# Altium schematic sheet 06-SX1276.SchDoc
size B; SheetNumber: 6; SheetTotal: 19
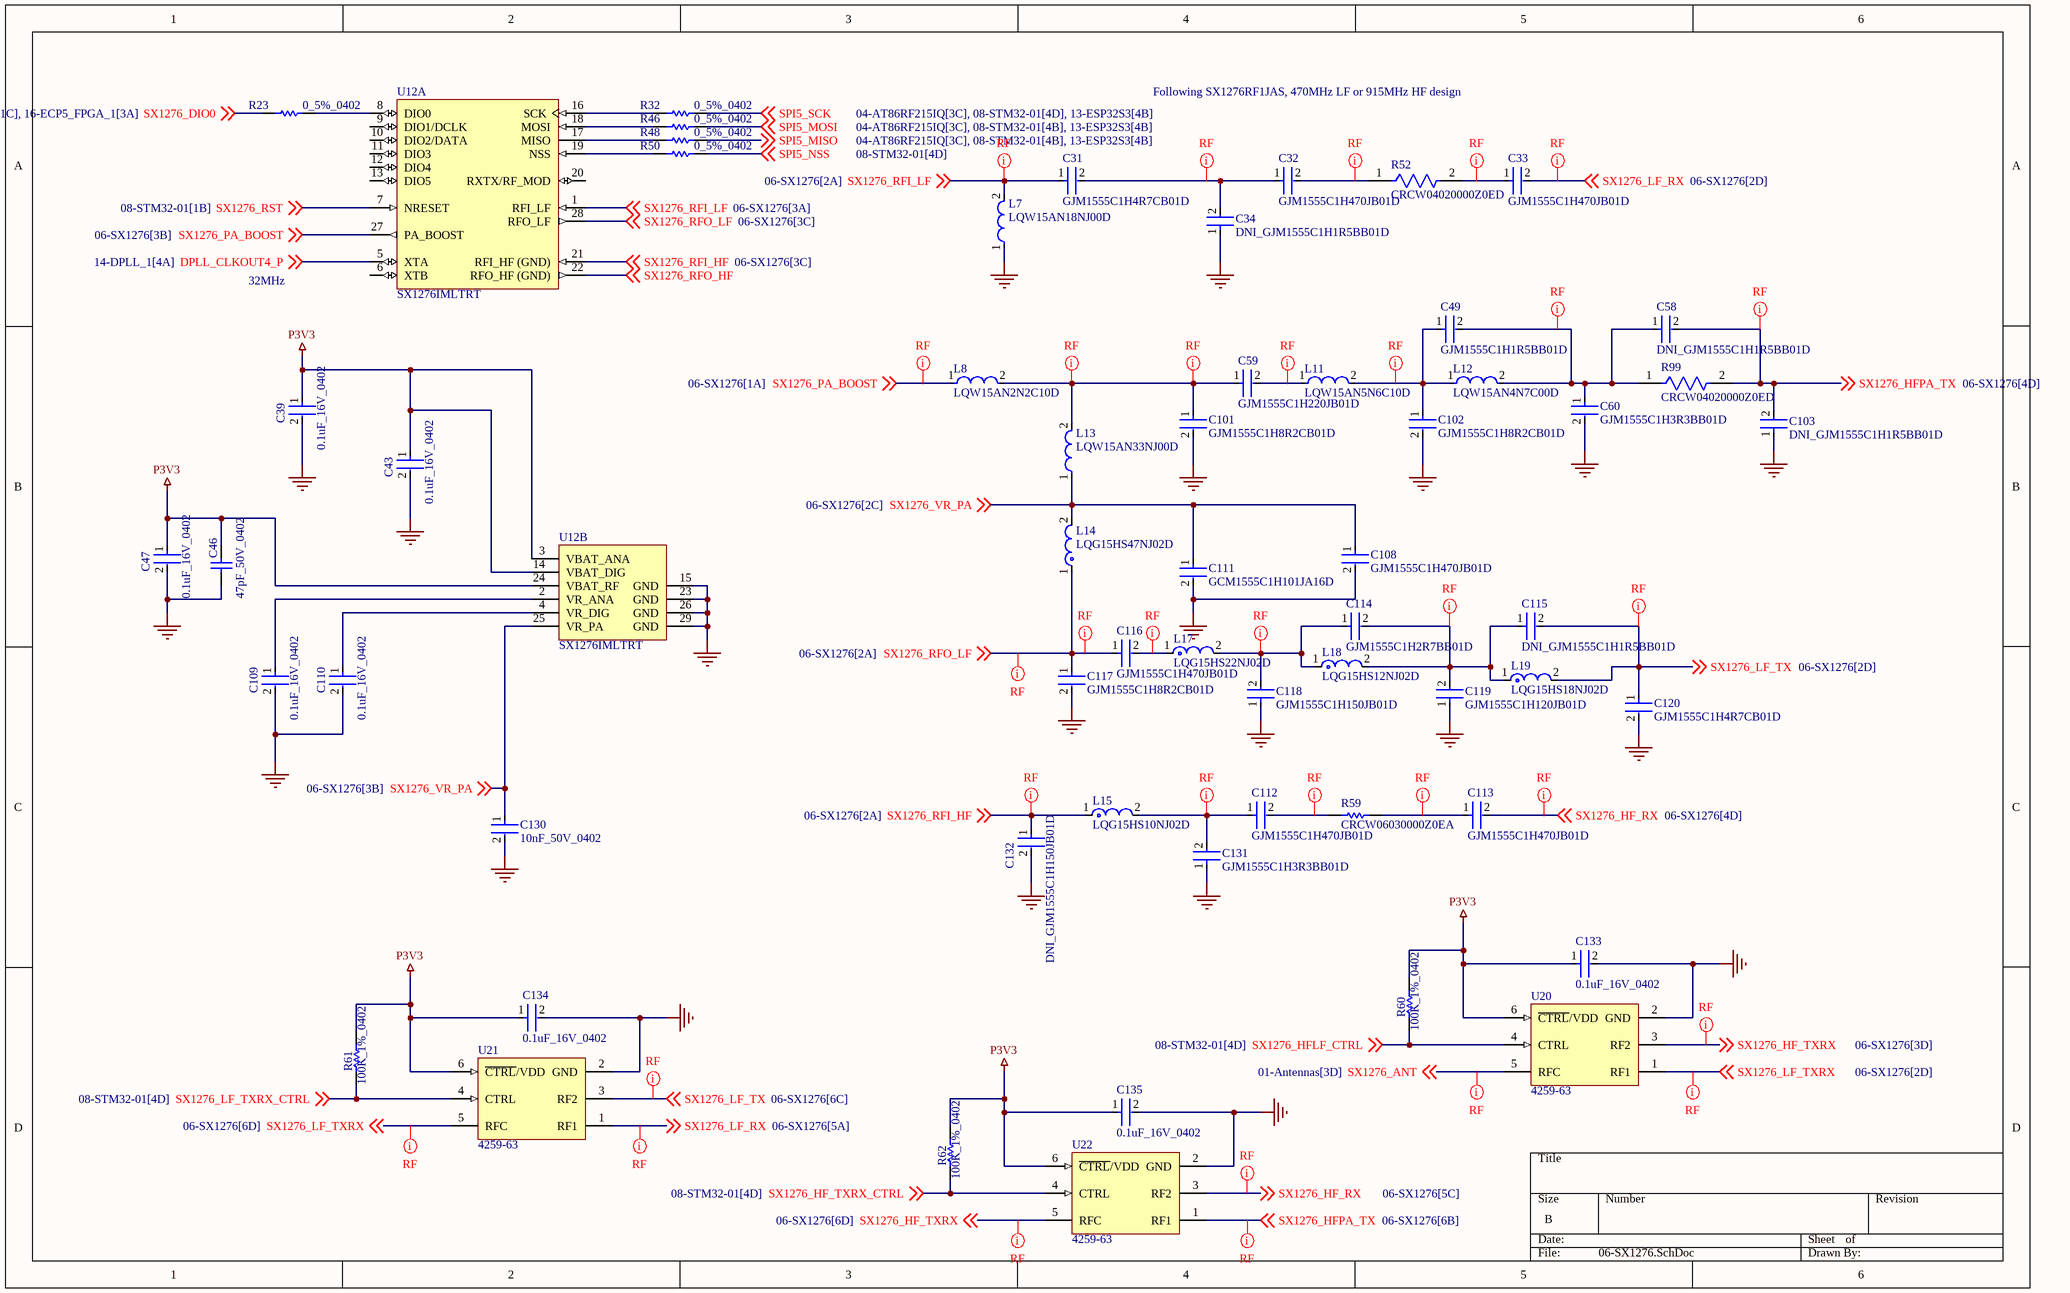
[diagram p0: 06-SX1276.SchDoc]

## Parts
C31  GJM1555C1H4R7CB01D  [FP-GJM155-0_05-IPC_B]
C32  GJM1555C1H470JB01D  [FP-GJM155-0_05-MFG]
C33  GJM1555C1H470JB01D  [FP-GJM155-0_05-MFG]
C34  DNI_GJM1555C1H1R5BB01D  [FP-GJM155-0_05-IPC_C]  (no BOM)
C39  0.1uF_16V_0402  [FP-C0402-BB-MFG]
C43  0.1uF_16V_0402  [FP-C0402-BB-MFG]
C46  47pF_50V_0402  [CAPC1005X55X25LL05T10]
C47  0.1uF_16V_0402  [FP-C0402-BB-MFG]
C49  GJM1555C1H1R5BB01D  [FP-GJM155-0_05-IPC_C]
C58  DNI_GJM1555C1H1R5BB01D  [FP-GJM155-0_05-IPC_C]  (no BOM)
C59  GJM1555C1H220JB01D  [FP-GJM155-0_05-IPC_C]
C60  GJM1555C1H3R3BB01D  [FP-GJM155-0_05-IPC_C]
C101  GJM1555C1H8R2CB01D  [FP-GJM155-0_05-IPC_C]
C102  GJM1555C1H8R2CB01D  [FP-GJM155-0_05-IPC_C]
C103  DNI_GJM1555C1H1R5BB01D  [FP-GJM155-0_05-IPC_C]  (no BOM)
C108  GJM1555C1H470JB01D  [FP-GJM155-0_05-MFG]
C109  0.1uF_16V_0402  [FP-C0402-BB-MFG]
C110  0.1uF_16V_0402  [FP-C0402-BB-MFG]
C111  GCM1555C1H101JA16D  [FP-GCM155-0_05-IPC_C]
C112  GJM1555C1H470JB01D  [FP-GJM155-0_05-MFG]
C113  GJM1555C1H470JB01D  [FP-GJM155-0_05-MFG]
C114  GJM1555C1H2R7BB01D  [FP-GJM155-0_05-IPC_A]
C115  DNI_GJM1555C1H1R5BB01D  [FP-GJM155-0_05-IPC_C]  (no BOM)
C116  GJM1555C1H470JB01D  [FP-GJM155-0_05-MFG]
C117  GJM1555C1H8R2CB01D  [FP-GJM155-0_05-IPC_C]
C118  GJM1555C1H150JB01D  [FP-GJM155-0_05-IPC_A]
C119  GJM1555C1H120JB01D  [FP-GJM155-0_05-IPC_A]
C120  GJM1555C1H4R7CB01D  [FP-GJM155-0_05-IPC_B]
C130  10nF_50V_0402  [FP-CL165-IPC_C]
C131  GJM1555C1H3R3BB01D  [FP-GJM155-0_05-IPC_C]
C132  DNI_GJM1555C1H150JB01D  [FP-GJM155-0_05-IPC_A]  (no BOM)
C133  0.1uF_16V_0402  [FP-C0402-BB-MFG]
C134  0.1uF_16V_0402  [FP-C0402-BB-MFG]
C135  0.1uF_16V_0402  [FP-C0402-BB-MFG]
L7  LQW15AN18NJ00D  [FP-LQW15AN_00-W0_6-0_1-MFG]
L8  LQW15AN2N2C10D  [FP-LQW15AN_00-W0_6-0_1-MFG]
L11  LQW15AN5N6C10D  [FP-LQW15AN_00-W0_6-0_1-MFG]
L12  LQW15AN4N7C00D  [FP-LQW15AN_00-W0_6-0_1-MFG]
L13  LQW15AN33NJ00D  [FP-LQW15AN_00-W0_5-0_1-MFG]
L14  LQG15HS47NJ02D  [FP-LQG15HH_02-IPC_B]
L15  LQG15HS10NJ02D  [FP-LQG15HH_02-IPC_A]
L17  LQG15HS22NJ02D  [FP-LQG15HH_02-MFG]
L18  LQG15HS12NJ02D  [FP-LQG15HH_02-IPC_A]
L19  LQG15HS18NJ02D  [FP-LQG15HH_02-MFG]
R23  0_5%_0402  [RESC1005X40X25NL05T10]
R32  0_5%_0402  [RESC1005X40X25NL05T10]
R46  0_5%_0402  [RESC1005X40X25NL05T10]
R48  0_5%_0402  [RESC1005X40X25NL05T10]
R50  0_5%_0402  [RESC1005X40X25NL05T10]
R52  CRCW04020000Z0ED  [FP-CRCW0402-e3-IPC_C]
R59  CRCW06030000Z0EA  [RESC1609X50X30NL8T20]
R60  100K_1%_0402  [RESC1005X40X25ML05T10]
R61  100K_1%_0402  [RESC1005X40X25ML05T10]
R62  100K_1%_0402  [RESC1005X40X25ML05T10]
R99  CRCW04020000Z0ED  [FP-CRCW0402-e3-IPC_C]
U12  SX1276IMLTRT  [SMTC-QFN-28_V]  (parts A,B of 2)
U20  4259-63  [PERE-SC-70-6_M]
U21  4259-63  [PERE-SC-70-6_M]
U22  4259-63  [PERE-SC-70-6_M]

## Nets
GND: C34.1 C39.2 C43.2 C46.1 C47.2 C60.2 C101.2 C102.2 C103.1 C108.2 C109.2 C110.2 C111.2 C117.2 C118.1 C119.1 C120.2 C130.2 C131.1 C132.2 C133.2 C134.2 C135.2 L7.1 U12.15(GND) U12.23(GND) U12.26(GND) U12.29(GND) U20.2(GND) U21.2(GND) U22.2(GND)
P3V3: C39.1 C43.1 C46.2 C47.1 C133.1 C134.1 C135.1 R60.2 R61.2 R62.2 U12.3(VBAT_ANA) U12.14(VBAT_DIG) U12.24(VBAT_RF) U20.6(~{CTRL}/VDD) U21.6(~{CTRL}/VDD) U22.6(~{CTRL}/VDD)
DPLL_CLKOUT4_P: U12.5(XTA) ; off-sheet DPLL_CLKOUT4_P
SPI5_MISO: R48.2 ; off-sheet SPI5_MISO
SPI5_MOSI: R46.2 ; off-sheet SPI5_MOSI
SPI5_NSS: R50.2 ; off-sheet SPI5_NSS
SPI5_SCK: R32.2 ; off-sheet SPI5_SCK
SX1276_ANT: U20.5(RFC) ; off-sheet SX1276_ANT
SX1276_DIO0: R23.1 ; off-sheet SX1276_DIO0
SX1276_HF_RX: C113.2 U22.3(RF2) ; off-sheet SX1276_HF_RX
SX1276_HF_TXRX: U20.3(RF2) U22.5(RFC) ; off-sheet SX1276_HF_TXRX
SX1276_HF_TXRX_CTRL: R62.1 U22.4(CTRL) ; off-sheet SX1276_HF_TXRX_CTRL
SX1276_HFLF_CTRL: R60.1 U20.4(CTRL) ; off-sheet SX1276_HFLF_CTRL
SX1276_HFPA_TX: C58.2 C103.2 R99.2 U22.1(RF1) ; off-sheet SX1276_HFPA_TX
SX1276_LF_RX: C33.2 U21.1(RF1) ; off-sheet SX1276_LF_RX
SX1276_LF_TX: C115.2 C120.1 L19.2 U21.3(RF2) ; off-sheet SX1276_LF_TX
SX1276_LF_TXRX: U20.1(RF1) U21.5(RFC) ; off-sheet SX1276_LF_TXRX
SX1276_LF_TXRX_CTRL: R61.1 U21.4(CTRL) ; off-sheet SX1276_LF_TXRX_CTRL
SX1276_PA_BOOST: L8.1 U12.27(PA_BOOST) ; off-sheet SX1276_PA_BOOST
SX1276_RFI_HF: C132.1 L15.1 U12.21(RFI_HF_(GND)) ; off-sheet SX1276_RFI_HF
SX1276_RFI_LF: C31.1 L7.2 U12.1(RFI_LF) ; off-sheet SX1276_RFI_LF
SX1276_RFO_HF: U12.22(RFO_HF_(GND)) ; off-sheet SX1276_RFO_HF
SX1276_RFO_LF: C116.1 C117.1 L14.1 U12.28(RFO_LF) ; off-sheet SX1276_RFO_LF
SX1276_RST: U12.7(NRESET) ; off-sheet SX1276_RST
SX1276_VR_PA: C108.1 C111.1 C130.1 L13.1 L14.2 U12.25(VR_PA) ; off-sheet SX1276_VR_PA
NetC31_2: C31.2 C32.1 C34.2
NetC32_2: C32.2 R52.1
NetC33_1: C33.1 R52.2
NetC49_1: C49.1 C102.1 L11.2 L12.1
NetC49_2: C49.2 C58.1 C60.1 L12.2 R99.1
NetC59_1: C59.1 C101.1 L8.2 L13.2
NetC59_2: C59.2 L11.1
NetC109_1: C109.1 U12.2(VR_ANA)
NetC110_1: C110.1 U12.4(VR_DIG)
NetC112_1: C112.1 C131.2 L15.2
NetC112_2: C112.2 R59.1
NetC113_1: C113.1 R59.2
NetC114_1: C114.1 C118.2 L17.2 L18.1
NetC114_2: C114.2 C115.1 C119.2 L18.2 L19.1
NetC116_2: C116.2 L17.1
NetR23_2: R23.2 U12.8(DIO0)
NetR32_1: R32.1 U12.16(SCK)
NetR46_1: R46.1 U12.18(MOSI)
NetR48_1: R48.1 U12.17(MISO)
NetR50_1: R50.1 U12.19(NSS)

Not connected (* = marked no-connect by the designer): U12 6(XTB) 9(DIO1/DCLK) 10(DIO2/DATA) 11(DIO3) 12(DIO4) 13(DIO5) 20(RXTX/RF_MOD)

## Layout directives
net class RF: NetC31_2, NetC32_2, NetC33_1, NetC49_1, NetC49_2, NetC59_1, NetC59_2, NetC112_1, NetC112_2, NetC113_1, NetC114_1, NetC114_2, NetC116_2, SX1276_ANT, SX1276_HF_RX, SX1276_HF_TXRX, SX1276_HFPA_TX, SX1276_LF_RX, SX1276_LF_TX, SX1276_LF_TXRX, SX1276_PA_BOOST, SX1276_RFI_HF, SX1276_RFI_LF, SX1276_RFO_LF

## Notes on the sheet
- Following SX1276RF1JAS, 470MHz LF or 915MHz HF design
- 32MHz

## Library data of the parts
C31 C120 = CMP-2008-03859-2: Multi-Layer Ceramic Capacitor 4.7pF C0G  ±0.25pF 0402 Paper T/R; Voltage Rating (DC): 50V; Temperature Coefficient: 30ppm/°C; Case/Package: 0402; Packaging: Tape and Reel; Package Quantity: 10000; Depth: 0.5mm; REACH SVHC: No SVHC; Height: 0.5mm; Lead Free: Lead Free; Number of Pins: 2; Case Code (Imperial): 0402; Width: 0.02inch; Max Operating Temperature: 125°C; Capacitance: 4.7pF; Dielectric: C0G; Lead Pitch: 0.3mm; Voltage Rating: 50V; Min Operating Temperature: -55°C; Thickness: 0.022inch; Voltage: 50V; Radiation Hardening: No; Mount: Surface Mount; Termination: SMD/SMT; Case Code (Metric): 1005; Length: 1mm
C32 C33 C108 C112 C113 C116 = CMP-06035-013708-1: Multi-Layer Ceramic Capacitor 47pF C0G  ±5% 0402 Paper T/R; Voltage Rating (DC): 50V; Capacitance: 47pF; Tolerance: 5%; Dielectric: C0G; Thickness: 500um; Length: 1mm; Width: 500um
C34 C49 C58 C103 C115 = CMP-2008-03820-2: Multi-Layer Ceramic Capacitor 1.5pF C0G  ±0.1pF 0402 Paper T/R; Temperature Coefficient: 30ppm/°C; Voltage Rating: 50V; Depth: 0.5mm; Case Code (Imperial): 0402; Package Quantity: 10000; Length: 1mm; Number of Pins: 2; Max Operating Temperature: 125°C; Mount: Surface Mount; Construction: Flat; Thickness: 0.022inch; Series: GJM; Packaging: Tape and Reel; Radiation Hardening: No; REACH SVHC: No SVHC; Case/Package: 0402; Lead Free: Lead Free; Voltage Rating (DC): 50V; Min Operating Temperature: -55°C; Dielectric: C0G; Termination: SMD/SMT; Width: 0.5mm; Capacitance: 1.5pF; Lead Pitch: 0.3mm; Case Code (Metric): 1005; Voltage: 50V; Height: 0.5mm
C39 C43 C47 C109 C110 C133-C135 = CMP-1034-02068-3: CAP CER 0.1UF 16V 5% X7R 0402; Manufacturer: Kemet; Manufacturer Part Number: C0402C104J4RACTU; Value: 0.10 μF; Temperature Coefficient: 15%; Tolerance: 0.05; Material: Ceramic; ComponentLink2URL: https://content.kemet.com/datasheets/KEM_C1002_X7R_SMD.pdf; Automotive: No; Device Class L2: Capacitors; Temperature: -55°C to +125°C; RoHS: TRUE; Voltage Rating: 16 V; ComponentLink2Description: Datasheet; Device Class L3: Ceramic Capacitors; Temperature Range Low: -55°C; Ipc Land Pattern Name: CAPC10050X50; Device Class L1: Passive Components; Temperature Range High: +125°C; Package: C0402-BB; Capacitance: 0.10 μF; Category: Cap; Mouser Description: CAP CER 0.1UF 16V X7R 0402; Height: 0.55mm; Digikey Description: CAP CER 0.1UF 16V 5% X7R 0402; Octopart: https://octopart.com/c0402c104j4ractu-kemet-12573893; Temperature Characteristic: X7R; Lead Free: Yes
C46 = CMP-2008-04368-1: Part Number: GRM1555C1H470JA01D; Manufacturer: Murata
C59 = CMP-06035-006261-1: Multi-Layer Ceramic Capacitor 22pF C0G  ±5% 0402 Paper T/R; Voltage Rating (DC): 50V; Length: 1mm; Width: 500um; Dielectric: C0G; Capacitance: 22pF; Thickness: 500um; Tolerance: 5%
C60 C131 = CMP-2008-03846-2: Multi-Layer Ceramic Capacitor 3.3pF C0G  ±0.1pF 0402 Paper T/R; Voltage: 50V; Lead Free: Lead Free; Thickness: 0.022inch; Mount: Surface Mount; Termination: SMD/SMT; Package Quantity: 1; Lead Pitch: 0.3mm; Case/Package: 0402; REACH SVHC: No SVHC; Case Code (Imperial): 0402; Number of Pins: 2; Height: 0.5mm; Width: 0.5mm; Depth: 0.5mm; Capacitance: 3.3pF; Packaging: Tape and Reel; Min Operating Temperature: -55°C; Length: 1mm; Dielectric: C0G; Case Code (Metric): 1005; Max Operating Temperature: 125°C; Voltage Rating (DC): 50V; Voltage Rating: 50V; Radiation Hardening: No
C101 C102 C117 = CMP-2008-03886-2: Multi-Layer Ceramic Capacitor 8.2pF C0G  ±0.25pF 0402 Paper T/R; Temperature Coefficient: 30ppm/°C; Voltage: 50V; Case Code (Metric): 1005; Max Operating Temperature: 125°C; Dielectric: C0G; Lead Free: Lead Free; Case/Package: 0402; Radiation Hardening: No; Length: 1mm; Thickness: 0.022inch; Case Code (Imperial): 0402; Number of Pins: 2; Depth: 0.5mm; Mount: Surface Mount; Termination: SMD/SMT; Voltage Rating (DC): 50V; Package Quantity: 1; Packaging: Tape and Reel; REACH SVHC: No SVHC; Min Operating Temperature: -55°C; Height: 0.5mm; Lead Pitch: 0.3mm; Capacitance: 8.2pF; Width: 0.5mm; Voltage Rating: 50V
C111 = CMP-2008-03694-3: Ceramic Capacitor for Automotive 100pF ±5% 50VDC C0G 0402 Paper T/R; Voltage: 50V; Ratings: AEC-Q200; Radiation Hardening: No; Min Operating Temperature: -55°C; Capacitance: 100pF; Depth: 0.5mm; Max Operating Temperature: 125°C; Length: 1mm; Height: 0.5mm; Termination: SMD/SMT; Voltage Rating: 50V; Dielectric: C0G; Package Quantity: 10000; Case Code (Imperial): 0402; Width: 0.02inch; Case/Package: 0402; Lead Free: Lead Free; Case Code (Metric): 1005; Voltage Rating (DC): 50V; Thickness: 0.022inch; Mount: Surface Mount; Tolerance: 5%; REACH SVHC: No SVHC; Weight: 0.000212oz; Packaging: Tape and Reel
C114 = CMP-2008-03840-2: Multi-Layer Ceramic Capacitor 2.7pF C0G  ±0.1pF 0402 Paper T/R; Voltage Rating (DC): 50V; Temperature Coefficient: 30ppm/°C; Max Operating Temperature: 125°C; Lead Free: Lead Free; REACH SVHC: No SVHC; Thickness: 0.022inch; Length: 1mm; Height: 0.5mm; Min Operating Temperature: -55°C; Mount: Surface Mount; Case/Package: 0402; Case Code (Imperial): 0402; Width: 0.02inch; Capacitance: 2.7pF; Packaging: Tape and Reel; Package Quantity: 10000; Lead Pitch: 0.3mm; Dielectric: C0G; Depth: 0.5mm; Voltage Rating: 50V; Radiation Hardening: No; Termination: SMD/SMT; Voltage: 50V; Number of Pins: 2; Case Code (Metric): 1005
C118 C132 = CMP-2008-03804-2: Multi-Layer Ceramic Capacitor 15pF C0G  ±5% 0402 Paper T/R; Voltage Rating (DC): 50V; Temperature Coefficient: 30ppm/°C; Dielectric: C0G; Max Operating Temperature: 125°C; Radiation Hardening: No; REACH SVHC: No SVHC; Case Code (Imperial): 0402; Package Quantity: 1; Thickness: 0.022inch; Min Operating Temperature: -55°C; Mount: Surface Mount; Tolerance: 5%; Voltage Rating: 50V; Depth: 0.5mm; Width: 0.02inch; Height: 0.5mm; Number of Pins: 2; Case Code (Metric): 1005; Lead Pitch: 0.3mm; Case/Package: 0402; Termination: SMD/SMT; Voltage: 50V; Length: 1mm; Capacitance: 15pF; Packaging: Tape and Reel; Lead Free: Lead Free
C119 = CMP-2008-03800-2: Multi-Layer Ceramic Capacitor 12pF C0G  ±5% 0402 Paper T/R; Voltage: 50V; Temperature Coefficient: 30ppm/°C; Tolerance: 5%; Package Quantity: 1; Dielectric: C0G; Height: 0.5mm; Voltage Rating: 50V; Radiation Hardening: No; Capacitance: 12pF; REACH SVHC: No SVHC; Voltage Rating (DC): 50V; Number of Pins: 2; Depth: 0.5mm; Mount: Surface Mount; Lead Free: Lead Free; Lead Pitch: 0.3mm; Width: 0.5mm; Min Operating Temperature: -55°C; Length: 1mm; Case/Package: 0402; Thickness: 0.022inch; Case Code (Metric): 1005; Packaging: Tape and Reel; Max Operating Temperature: 125°C; Case Code (Imperial): 0402; Termination: SMD/SMT
C130 = CMP-13271-000387-1: Cap Ceramic 10nF 50V X7R ±10% SMD 0402 +125°C Paper T/R; Depth: 0.5mm; Length: 1mm; Lead Free: Lead Free; Case Code (Metric): 1005; Width: 0.02inch; Min Operating Temperature: -55°C; Thickness: 0.022inch; Package Quantity: 1; Mount: Surface Mount; Height: 0.5mm; Voltage: 50V; Material: Ceramic; Tolerance: 10%; Case Code (Imperial): 0402; Radiation Hardening: No; Case/Package: 0402; Max Operating Temperature: 125°C; Voltage Rating (DC): 50V; Contact Plating: Tin; Packaging: Tape and Reel; Voltage Rating: 50V; Capacitance: 10nF; Dielectric: X7R
L7 = CMP-06042-006916-1: Wire Wound RF Inductor 18nH ±5% 370mA 0.27Ω 0402 (1005); Q Factor: 25; DC Resistance (DCR): 270mR; Test Frequency: 100MHz; Self Resonant Frequency: 4.5GHz; Core Material: Air; Shielding: Unshielded; Inductance: 18nH; Lead Free: Lead Free; Resistor Type: Wirewound; Height: 0.5mm; Width: 0.02inch; Max DC Current: 370mA; Case/Package: 0402; Radiation Hardening: No; Min Operating Temperature: -55°C; Packaging: Tape and Reel; DC Current: 370mA; Tolerance: 5%; Max Operating Temperature: 125°C; Weight: 2.8E-05oz; Current Rating: 370mA; Military Standard: Not; Termination: SMD/SMT; Length: 1mm; Case Code (Metric): 1005; Mount: Surface Mount; Case Code (Imperial): 0402; Package Quantity: 10000; Depth: 0.7mm
L8 = CMP-06042-008786-1: Wire Wound RF Inductor 2.2nH ±0.2nH 1000mA 0.027Ω 0402 (1005); Q Factor: 25; Current Rating: 1A; Core Material: Air; Test Frequency: 100MHz; Shielding: Unshielded; DC Resistance (DCR): 27mR; Self Resonant Frequency: 14GHz; Min Operating Temperature: -55°C; Package Quantity: 10000; Length: 1mm; Number of Pins: 2; Radiation Hardening: No; Case Code (Metric): 1005; Termination: SMD/SMT; Inductance: 2.2nH; Mount: Surface Mount; DC Current: 1A; Military Standard: Not; Max Operating Temperature: 125°C; Max DC Current: 1A; Lead Free: Lead Free; Depth: 0.7mm; Case/Package: 0402; Packaging: Tape and Reel; Height: 0.5mm; Width: 0.5mm; REACH SVHC: No SVHC; Weight: 2.8E-05oz; Case Code (Imperial): 0402
L11 = CMP-06042-014099-1: Wire Wound RF Inductor 5.6nH ±0.2nH 800mA 0.051Ω 0402 (1005); DC Resistance (DCR): 51mR; Self Resonant Frequency: 8GHz; Shielding: Unshielded; Core Material: Air; Q Factor: 30; Test Frequency: 100MHz; Depth: 0.7mm; Weight: 2.8E-05oz; Width: 0.5mm; Height: 0.5mm; DC Current: 800mA; Packaging: Tape and Reel; Max DC Current: 800mA; Case Code (Metric): 1005; Military Standard: Not; Case/Package: 0402; Inductance: 5.6nH; Package Quantity: 1; Termination: SMD/SMT; Resistor Type: Wirewound; Mount: Surface Mount; Lead Free: Lead Free; Min Operating Temperature: -55°C; Number of Pins: 2; REACH SVHC: No SVHC; Radiation Hardening: No; Length: 1mm; Current Rating: 800mA; Case Code (Imperial): 0402; Max Operating Temperature: 125°C
L12 = CMP-06042-000468-1: Wire Wound RF Inductor 4.7nH ±0.2nH 750mA 0.07Ω 0402 (1005); Q Factor: 25; Core Material: Air; Test Frequency: 100MHz; DC Resistance (DCR): 70mR; Self Resonant Frequency: 8GHz; Shielding: Unshielded; Packaging: Tape and Reel; Termination: SMD/SMT; Length: 1mm; Lead Free: Lead Free; Min Operating Temperature: -55°C; Height: 0.5mm; Military Standard: Not; Case Code (Metric): 1005; Width: 0.02inch; Inductance: 4.7nH; Case Code (Imperial): 0402; REACH SVHC: No SVHC; Weight: 2.8E-05oz; Current Rating: 750mA; Max Operating Temperature: 125°C; Number of Pins: 2; Package Quantity: 10000; Radiation Hardening: No; DC Current: 750mA; Max DC Current: 750mA; Case/Package: 0402; Depth: 0.7mm; Mount: Surface Mount
L13 = CMP-06042-007456-1: Wire Wound RF Inductor 33nH ±5% 260mA 0.63Ω 0402 (1005); Test Frequency: 100MHz; Core Material: Air; Shielding: Unshielded; Q Factor: 25; Self Resonant Frequency: 3.2GHz; DC Resistance (DCR): 630mR; Width: 0.5mm; Tolerance: 5%; Case Code (Imperial): 0402; Max Operating Temperature: 125°C; Inductance: 33nH; Weight: 2.8E-05oz; Case Code (Metric): 1005; Lead Free: Lead Free; Case/Package: 0402; Max DC Current: 260mA; Military Standard: Not; Length: 1mm; Packaging: Tape and Reel; Mount: Surface Mount; Package Quantity: 10000; Min Operating Temperature: -55°C; Resistor Type: Wirewound; Radiation Hardening: No; Height: 0.5mm; Termination: SMD/SMT; DC Current: 260mA; Current Rating: 260mA; Depth: 0.6mm
L14 = CMP-06042-015783-1: Multilayer type RF Inductor 47nH ±5% 0.72Ω 300mA 0402; Core Material: Air; DC Resistance (DCR): 720mR; DC Current: 200mA; Shielding: Unshielded; Self Resonant Frequency: 1GHz; Q Factor: 8; Test Frequency: 100MHz; Tolerance: 5%; Packaging: Tape and Reel; Case Code (Imperial): 0402; Max Operating Temperature: 125°C; Military Standard: Not; Length: 1mm; Radiation Hardening: No; Height: 0.5mm; Min Operating Temperature: -55°C; Width: 0.02inch; Inductance: 47nH; Lead Free: Lead Free; Termination: SMD/SMT; Height - Seated (Max): 0.022inch; Rated Current-Max: 200mA; Case/Package: 0402; Max DC Current: 200mA; Series: LQG15HS; Case Code (Metric): 1005; Mount: Surface Mount; Current Rating: 200mA; Depth: 0.55mm; Package Quantity: 1
L15 = CMP-06042-014117-1: Multilayer type RF Inductor 10nH ±5% 0.26Ω 500mA 0402; DC Resistance (DCR): 260mR; DC Current: 300mA; Shielding: Unshielded; Q Factor: 8; Test Frequency: 100MHz; Self Resonant Frequency: 3.4GHz; Core Material: Air; Width: 0.5mm; Radiation Hardening: No; Packaging: Tape and Reel; Lead Free: Lead Free; Military Standard: Not; Case/Package: 0402; Current Rating: 300mA; Case Code (Metric): 1005; Length: 0.039inch; Termination: SMD/SMT; Max DC Current: 300mA; Max Operating Temperature: 125°C; Mount: Surface Mount; Height - Seated (Max): 0.022inch; Package Quantity: 10000; Height: 0.5mm; Inductance: 10nH; Tolerance: 5%; Case Code (Imperial): 0402; Depth: 0.55mm; Min Operating Temperature: -55°C
L17 = CMP-06042-006776-1: Multilayer type RF Inductor 22nH ±5% 0.42Ω 350mA 0402; Current Rating: 300mA; Core Material: Air; Test Frequency: 100MHz; Self Resonant Frequency: 1.9GHz; Q Factor: 8; Shielding: Unshielded; DC Resistance (DCR): 420mR; Mount: Surface Mount; Lead Free: Lead Free; Military Standard: Not; Height - Seated (Max): 0.022inch; Case Code (Imperial): 0402; Length: 1mm; Max Operating Temperature: 125°C; Case/Package: 0402; Width: 0.02inch; Tolerance: 5%; Case Code (Metric): 1005; Min Operating Temperature: -55°C; Max DC Current: 300mA; Height: 0.5mm; Radiation Hardening: No; Depth: 0.55mm; Packaging: Tape and Reel; Termination: SMD/SMT; DC Current: 300mA; Inductance: 22nH; Package Quantity: 10000
L18 = CMP-2000-06576-2: Multilayer type RF Inductor 12nH ±5% 0.28Ω 500mA 0402; Self Resonant Frequency: 3GHz; Current Rating: 300mA; Core Material: Air; Shielding: Unshielded; Q Factor: 8; Test Frequency: 100MHz; DC Resistance (DCR): 280mR; Mount: Surface Mount; Width: 0.5mm; Tolerance: 5%; Lead Free: Lead Free; Max Operating Temperature: 125°C; Height - Seated (Max): 0.022inch; Case Code (Metric): 1005; Min Operating Temperature: -55°C; Depth: 0.55mm; Package Quantity: 10000; Case Code (Imperial): 0402; Termination: SMD/SMT; Max DC Current: 300mA; Radiation Hardening: No; Length: 0.039inch; Packaging: Tape and Reel; Inductance: 12nH; DC Current: 300mA; Weight: 2.3E-05oz; Case/Package: 0402; Military Standard: Not; Height: 0.5mm
L19 = CMP-06042-000668-1: Multilayer type RF Inductor 18nH ±5% 0.36Ω 400mA 0402; DC Current: 300mA; Test Frequency: 100MHz; Self Resonant Frequency: 2.2GHz; Shielding: Unshielded; Core Material: Air; DC Resistance (DCR): 360mR; Q Factor: 8; Inductance: 18nH; Military Standard: Not; REACH SVHC: No SVHC; Tolerance: 5%; Inductance Tolerance: 5%; Weight: 2.3E-05oz; Lead Free: Lead Free; Depth: 0.55mm; Current Rating: 300mA; Max DC Current: 300mA; Max Operating Temperature: 125°C; Length: 0.039inch; Min Operating Temperature: -55°C; Width: 0.5mm; Radiation Hardening: No; Termination: SMD/SMT; Height: 0.5mm; Package Quantity: 10000; Packaging: Tape and Reel; Case/Package: 0402; Case Code (Imperial): 0402; Mount: Surface Mount; Height - Seated (Max): 0.022inch; Case Code (Metric): 1005
R23 R32 R46 R48 R50 = CMP-2002-06457-1: Manufacturer: Panasonic; Part Number: ERJ-U020R00X
R52 R99 = CMP-2002-08122-2: RES Thick Film, 0Ω, 0.063W, 0402; Tolerance: 5%; Max Power Dissipation: 63mW; Voltage Rating: 50V; Temperature Coefficient: 100ppm/°C; Resistance: 0mR; Contact Plating: Tin; Height: 0.35mm; Radiation Hardening: No; Features: Automotive AEC-Q200; Composition: Thick Film; Width: 0.5mm; Weight: 2.3E-05oz; Termination: SMD/SMT; Packaging: Tape and Reel; Mount: Surface Mount; Case Code (Metric): 1005; Military Standard: Not; Min Operating Temperature: -55°C; Number of Terminations: 2; Package Quantity: 1; Case Code (Imperial): 0402; Depth: 0.5mm; Max Operating Temperature: 155°C; Case/Package: 0402; Power Rating: 63mW; Lead Free: Lead Free; Voltage Rating (DC): 50V; Length: 1mm
R59 = CMP-2000-03816-5: Chip Resistor, 0 Ohm, Jumper, 100 mW, -55 to 155 degC, 0603 (1608 Metric), RoHS, Tape and Reel; Manufacturer: Vishay Semiconductor; Voltage Rating: 75 V; Package Quantity: 5000; DatasheetVersion: 06/2012; Min Operating Temperature: -55 degC; ComponentLink1URL: http://www.vishay.com/; Mounting Technology: Surface Mount; Height: 0.45 mm; ComponentLink1Description: Manufacturer URL; REACH SVHC: Unknown; PackageReference: 0603; Packaging: Tape and Reel; Max Operating Temperature: 155 degC; Mount: Surface Mount; ComponentLink2Description: Datasheet; PackageDescription: 2-Pin Surface Mount Device, Body 1.575 x 0.85 mm; Length: 1.55 mm; ComponentLink2URL: http://www.vishay.com/docs/20035/dcrcwe3.pdf; Pins: 2; RoHSCompliant: true
R60-R62 = CMP-2002-07852-1: Manufacturer: Yageo; Part Number: RC0402FR-13100KL
U12 = CMP-2000-05356-1: Low Power Long Range Transceiver, 137 to 1020 MHz, -40 to 85 degC, 28-Pin QFN, RoHS, Tape and Reel; Manufacturer: Semtech; Power - Output: 20dBm; Data Rate (Max): 300kbps; Sensitivity: -148dBm; Featured Product: SX1276LongRangeTransceiver; PCN Design/Specification: CopperWire25/Mar/2014; GPIO: 6; Frequency: 137MHz~1.02GHz; Voltage - Supply: 1.8V~3.7V; Protocol: LoRa™; Current - Transmitting: 20mA~120mA; Current - Receiving: 10.8mA~12mA; Online Catalog: SX1276,SX1277andSX1278; Design Resources: SX127xReferenceDesignOverviewDevelopmentToolSelector; Serial Interfaces: SPI; Mfg Application Notes: LoRaModulation:CrystalOscillatorGuidanceSX12xxSoftwareImplementationofDataWhiteningandCRCSX127xLoRaLowEnergyDesignGuideSX127xLoRaModemDesignersGuide; Modulation: FSK,GFSK,GMSK,MSK,OOK; Other Names: SX1276IMLTRTTR; Series: -; Manufacturer URL: http://www.semtech.com/; Datasheet URL: http://www.semtech.com/images/datasheet/sx1276.pdf; Type: TxRx+MCU; RF Family/Standard: 802.15.4; Package Reference: QFN-28; Standard Package: 3,000; Package Description: 28-Pin Quad Flat No-lead Package, Body 6 x 6 mm, Pitch 0.65 mm; Category: RF/IFandRFID; Operating Temperature: -40degC~85degC; Datasheet Version: Rev. 4, 03/2015; Memory Size: -; Family: RFTransceiverICs; Packaging: Tape&Reel(TR); Package / Case: 28-VQFNExposedPad
U20-U22 = CMP-2000-05298-1: IC RF Switch SPDT, 50 Ohm, 6-Pin SC70, RoHS, Tape and Reel; Manufacturer: Peregrine Semiconductor; P1dB: 29dBm(typ)IP1dB; Topology: Reflective; Frequency - Upper: 3GHz; Insertion Loss @ Frequency: 0.5dB@2GHz; IIP3: 55dBm(typ); Voltage - Supply: 1.8V~3.3V; Other Names: 1046-1011-24259-63-ND425963PE4259PE4259SCBC-ZPE4259SCBC-Z-ND; Isolation @ Frequency: 20dB@2GHz(typ); Frequency - Lower: 10MHz; Online Catalog: PE4259; Impedance: 50Ohm; RF Type: GeneralPurpose; Series: UltraCMOS; Manufacturer URL: http://www.psemi.com/; Package Description: 6-Pin Small Outline Transistor, Body 2.05 x 1.25 mm, Pitch 0.65 mm; Family: RFSwitches; Packaging: Tape&Reel(TR); Features: Single/DualLineControl; Package / Case: 6-TSSOP,SC-88,SOT-363; Operating Temperature: -40degC~85degC; Circuit: SPDT; Supplier Device Package: SC-70-6; Standard Package: 3,000; Datasheet URL: https://datasheet.ciiva.com/15100/getdatasheetpartid-685660-15100501.pdf; Category: RF/IFandRFID; Datasheet Version: Jan-11; Package Reference: SC-70-6